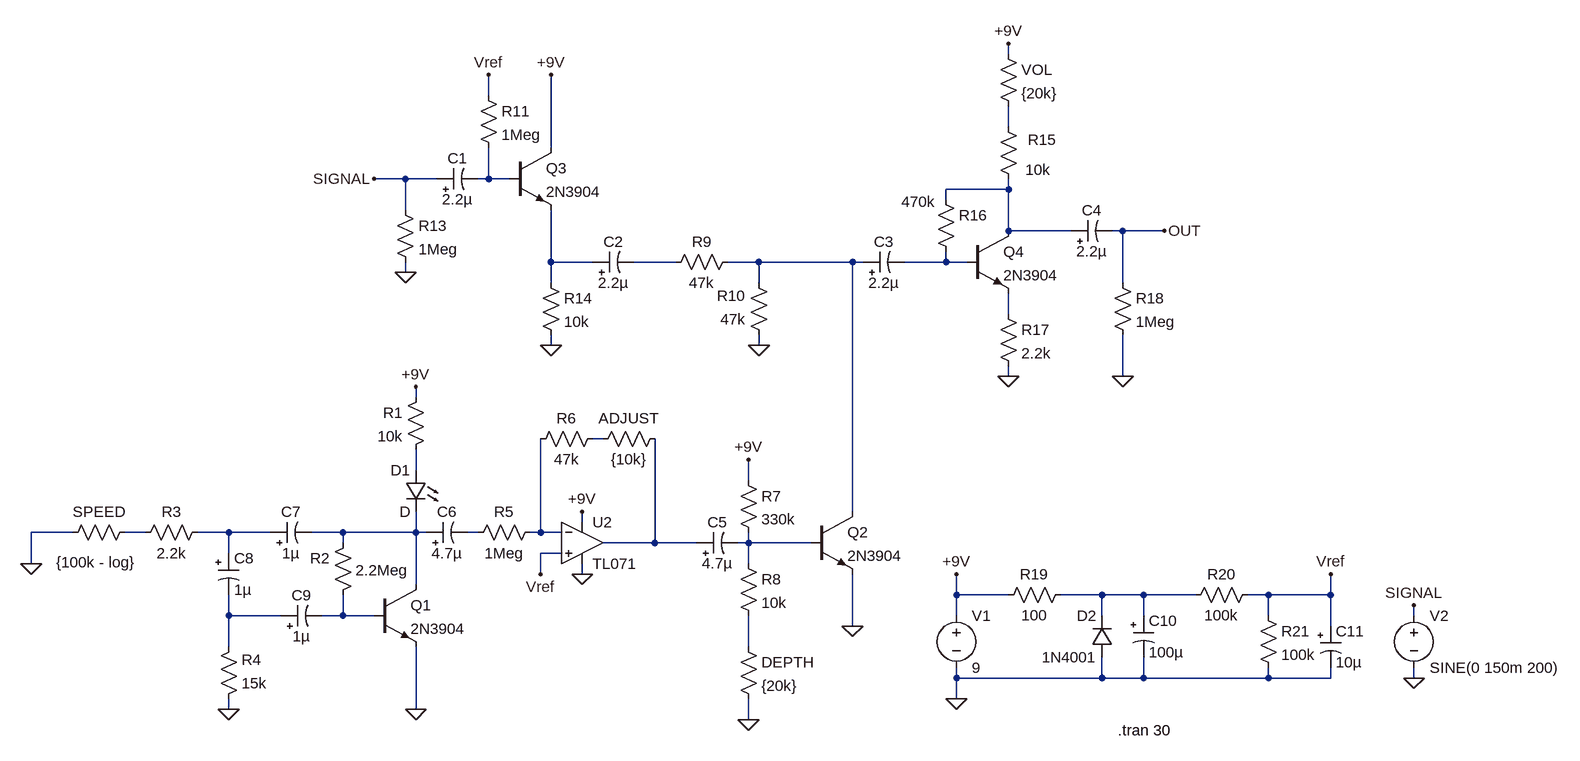
[diagram p0: schematic HatchetV2.asc]
HatchetV2.asc, the LTspice schematic file:
Version 4
SHEET 1 2232 680
WIRE 1376 -544 1376 -560
WIRE 576 -480 576 -512
WIRE 1376 -432 1376 -464
WIRE 672 -400 672 -512
WIRE 448 -352 400 -352
WIRE 496 -352 448 -352
WIRE 576 -352 576 -400
WIRE 576 -352 560 -352
WIRE 608 -352 576 -352
WIRE 1376 -336 1376 -352
WIRE 1376 -336 1280 -336
WIRE 1280 -320 1280 -336
WIRE 448 -304 448 -352
WIRE 1376 -272 1376 -336
WIRE 1472 -272 1376 -272
WIRE 1552 -272 1536 -272
WIRE 1616 -272 1552 -272
WIRE 672 -224 672 -304
WIRE 736 -224 672 -224
WIRE 864 -224 800 -224
WIRE 992 -224 944 -224
WIRE 1136 -224 992 -224
WIRE 1152 -224 1136 -224
WIRE 1280 -224 1280 -240
WIRE 1280 -224 1216 -224
WIRE 1312 -224 1280 -224
WIRE 448 -208 448 -224
WIRE 672 -192 672 -224
WIRE 992 -192 992 -224
WIRE 1552 -192 1552 -272
WIRE 1376 -144 1376 -176
WIRE 672 -96 672 -112
WIRE 992 -96 992 -112
WIRE 1376 -48 1376 -64
WIRE 1552 -48 1552 -112
WIRE 464 -16 464 -32
WIRE 752 48 736 48
WIRE 464 96 464 64
WIRE 976 112 976 80
WIRE 1136 160 1136 -224
WIRE 720 176 720 160
WIRE -64 192 -128 192
WIRE 48 192 16 192
WIRE 176 192 128 192
WIRE 240 192 176 192
WIRE 352 192 304 192
WIRE 464 192 464 160
WIRE 464 192 352 192
WIRE 480 192 464 192
WIRE 560 192 544 192
WIRE 656 192 656 48
WIRE 656 192 640 192
WIRE 688 192 656 192
WIRE 352 208 352 192
WIRE 832 208 832 48
WIRE 832 208 752 208
WIRE 896 208 832 208
WIRE 976 208 976 192
WIRE 976 208 960 208
WIRE 1072 208 976 208
WIRE 176 224 176 192
WIRE 688 224 656 224
WIRE -128 240 -128 192
WIRE 976 240 976 208
WIRE 656 256 656 224
WIRE 720 256 720 240
WIRE 464 272 464 192
WIRE 1296 288 1296 256
WIRE 1376 288 1296 288
WIRE 1520 288 1456 288
WIRE 1584 288 1520 288
WIRE 1664 288 1584 288
WIRE 1776 288 1744 288
WIRE 1872 288 1872 256
WIRE 1872 288 1776 288
WIRE 176 320 176 288
WIRE 256 320 176 320
WIRE 352 320 352 288
WIRE 352 320 320 320
WIRE 400 320 352 320
WIRE 1296 320 1296 288
WIRE 1520 320 1520 288
WIRE 1584 320 1584 288
WIRE 1776 320 1776 288
WIRE 2000 320 2000 304
WIRE 1136 336 1136 256
WIRE 1872 336 1872 288
WIRE 176 368 176 320
WIRE 976 368 976 320
WIRE 1296 416 1296 400
WIRE 1520 416 1520 384
WIRE 1520 416 1296 416
WIRE 1584 416 1584 384
WIRE 1584 416 1520 416
WIRE 1776 416 1776 400
WIRE 1776 416 1584 416
WIRE 1872 416 1872 400
WIRE 1872 416 1776 416
WIRE 2000 416 2000 400
WIRE 1296 448 1296 416
WIRE 176 464 176 448
WIRE 464 464 464 368
WIRE 976 480 976 448
FLAG 464 464 0
FLAG 464 -32 +9V
FLAG 176 464 0
FLAG 720 256 0
FLAG 720 160 +9V
FLAG 656 256 Vref
FLAG 976 80 +9V
FLAG 976 480 0
FLAG 1136 336 0
FLAG 992 -96 0
FLAG 672 -512 +9V
FLAG 672 -96 0
FLAG 1376 -48 0
FLAG 1616 -272 OUT
FLAG 576 -512 Vref
FLAG 448 -208 0
FLAG 1552 -48 0
FLAG 1296 448 0
FLAG 1296 256 +9V
FLAG 1872 256 Vref
FLAG 2000 416 0
FLAG 2000 304 SIGNAL
FLAG 1376 -560 +9V
FLAG 400 -352 SIGNAL
FLAG -128 240 0
SYMBOL npn 400 272 R0
SYMATTR InstName Q1
SYMATTR Value 2N3904
SYMBOL Res 480 -32 M0
SYMATTR InstName R1
SYMATTR Value 10k
SYMBOL LED 480 96 M0
SYMATTR InstName D1
SYMBOL Res 368 192 M0
WINDOW 3 -84 58 Left 2
SYMATTR InstName R2
SYMATTR Value 2.2Meg
SYMBOL Res 160 464 M180
WINDOW 0 36 76 Left 2
WINDOW 3 36 40 Left 2
SYMATTR InstName R4
SYMATTR Value 15k
SYMBOL TL071 720 208 R0
SYMATTR InstName U2
SYMBOL Res 656 176 R90
WINDOW 0 0 56 VBottom 2
WINDOW 3 32 56 VTop 2
SYMATTR InstName R5
SYMATTR Value 1Meg
SYMBOL Res 960 96 R0
SYMATTR InstName R7
SYMATTR Value 330k
SYMBOL Res 960 224 R0
SYMATTR InstName R8
SYMATTR Value 10k
SYMBOL npn 1072 160 R0
SYMATTR InstName Q2
SYMATTR Value 2N3904
SYMBOL Res 960 -240 R90
WINDOW 0 0 56 VBottom 2
WINDOW 3 32 56 VTop 2
SYMATTR InstName R9
SYMATTR Value 47k
SYMBOL Res 1008 -96 R180
WINDOW 0 36 76 Left 2
WINDOW 3 36 40 Left 2
SYMATTR InstName R10
SYMATTR Value 47k
SYMBOL npn 608 -400 R0
SYMATTR InstName Q3
SYMATTR Value 2N3904
SYMBOL Res 560 -496 R0
SYMATTR InstName R11
SYMATTR Value 1Meg
SYMBOL Res 656 -208 R0
SYMATTR InstName R14
SYMATTR Value 10k
SYMBOL npn 1312 -272 R0
SYMATTR InstName Q4
SYMATTR Value 2N3904
SYMBOL Res 1360 -448 R0
WINDOW 0 46 36 Left 2
WINDOW 3 42 82 Left 2
SYMATTR InstName R15
SYMATTR Value 10k
SYMBOL Res 1264 -336 R0
WINDOW 3 -53 19 Left 2
SYMATTR InstName R16
SYMATTR Value 470k
SYMBOL Res 1360 -160 R0
SYMATTR InstName R17
SYMATTR Value 2.2k
SYMBOL Res 144 176 R90
WINDOW 0 0 56 VBottom 2
WINDOW 3 32 56 VTop 2
SYMATTR InstName R3
SYMATTR Value 2.2k
SYMBOL Res 32 176 R90
WINDOW 0 0 56 VBottom 2
WINDOW 3 46 60 VTop 2
SYMATTR InstName SPEED
SYMATTR Value {100k - log}
SYMBOL polcap 496 -336 R270
WINDOW 0 32 32 VTop 2
WINDOW 3 0 32 VBottom 2
SYMATTR InstName C1
SYMATTR Value 2.2µ
SYMBOL polcap 736 -208 R270
WINDOW 0 32 32 VTop 2
WINDOW 3 0 32 VBottom 2
SYMATTR InstName C2
SYMATTR Value 2.2µ
SYMBOL polcap 1152 -208 R270
WINDOW 0 32 32 VTop 2
WINDOW 3 0 32 VBottom 2
SYMATTR InstName C3
SYMATTR Value 2.2µ
SYMBOL polcap 1472 -256 R270
WINDOW 0 32 32 VTop 2
WINDOW 3 0 32 VBottom 2
SYMATTR InstName C4
SYMATTR Value 2.2µ
SYMBOL polcap 896 224 R270
WINDOW 0 32 32 VTop 2
WINDOW 3 0 32 VBottom 2
SYMATTR InstName C5
SYMATTR Value 4.7µ
SYMBOL polcap 480 208 R270
WINDOW 0 32 32 VTop 2
WINDOW 3 0 32 VBottom 2
SYMATTR InstName C6
SYMATTR Value 4.7µ
SYMBOL polcap 240 208 R270
WINDOW 0 32 32 VTop 2
WINDOW 3 0 32 VBottom 2
SYMATTR InstName C7
SYMATTR Value 1µ
SYMBOL polcap 160 224 R0
SYMATTR InstName C8
SYMATTR Value 1µ
SYMBOL polcap 256 336 R270
WINDOW 0 32 32 VTop 2
WINDOW 3 0 32 VBottom 2
SYMATTR InstName C9
SYMATTR Value 1µ
SYMBOL Res 432 -320 R0
SYMATTR InstName R13
SYMATTR Value 1Meg
SYMBOL Res 1536 -208 R0
SYMATTR InstName R18
SYMATTR Value 1Meg
SYMBOL Voltage 1296 304 R0
SYMATTR InstName V1
SYMATTR Value 9
SYMBOL Res 1472 272 R90
WINDOW 0 0 56 VBottom 2
WINDOW 3 32 56 VTop 2
SYMATTR InstName R19
SYMATTR Value 100
SYMBOL diode 1536 384 R180
WINDOW 0 24 64 Left 2
WINDOW 3 24 0 Left 2
SYMATTR InstName D2
SYMATTR Value 1N4001
SYMBOL polcap 1568 320 R0
SYMATTR InstName C10
SYMATTR Value 100µ
SYMBOL Res 1760 272 R90
WINDOW 0 0 56 VBottom 2
WINDOW 3 32 56 VTop 2
SYMATTR InstName R20
SYMATTR Value 100k
SYMBOL Res 1760 304 R0
SYMATTR InstName R21
SYMATTR Value 100k
SYMBOL polcap 1856 336 R0
SYMATTR InstName C11
SYMATTR Value 10µ
SYMBOL Voltage 2000 304 R0
SYMATTR InstName V2
SYMATTR Value SINE(0 150m 200)
SYMBOL Res 960 352 R0
SYMATTR InstName DEPTH
SYMATTR Value {20k}
SYMBOL Res 1360 -560 R0
SYMATTR InstName VOL
SYMATTR Value {20k}
SYMBOL Res 752 32 R90
WINDOW 0 0 56 VBottom 2
WINDOW 3 32 56 VTop 2
SYMATTR InstName R6
SYMATTR Value 47k
SYMBOL Res 848 32 R90
WINDOW 0 0 56 VBottom 2
WINDOW 3 32 56 VTop 2
SYMATTR InstName ADJUST
SYMATTR Value {10k}
TEXT 1544 496 Left 2 !.tran 30

The netlist it stands for:
* HatchetV2.asc
Q1 N013 N020 0 0 2N3904
R1 +9V N010 10k
D1 N010 N013 D
R2 N013 N020 2.2Meg
R4 0 N019 15k
* U2: TL071 (symbol TL071 not available, pins judged from their places): In+=Vref In-=N015 V+=+9V V-=0 OUT=N016
R5 N015 N014 1Meg
R7 +9V N017 330k
R8 N017 N021 10k
Q2 N006 N017 0 0 2N3904
R9 N006 N005 47k
R10 0 N006 47k
Q3 +9V N002 N004 0 2N3904
R11 Vref N002 1Meg
R14 N004 0 10k
Q4 N003 N007 N008 0 2N3904
R15 N001 N003 10k
R16 N003 N007 470k
R17 N008 0 2.2k
R3 N012 N011 2.2k
R§SPEED N011 0 {100k - log}
C1 SIGNAL N002 2.2µ
C2 N004 N005 2.2µ
C3 N006 N007 2.2µ
C4 N003 OUT 2.2µ
C5 N016 N017 4.7µ
C6 N013 N014 4.7µ
C7 N012 N013 1µ
C8 N012 N019 1µ
C9 N019 N020 1µ
R13 SIGNAL 0 1Meg
R18 OUT 0 1Meg
V1 +9V 0 9
R19 N018 +9V 100
D2 0 N018 1N4001
C10 N018 0 100µ
R20 Vref N018 100k
R21 Vref 0 100k
C11 Vref 0 10µ
V2 SIGNAL 0 SINE(0 150m 200)
R§DEPTH N021 0 {20k}
R§VOL +9V N001 {20k}
R6 N009 N015 47k
R§ADJUST N016 N009 {10k}
.model D D
.lib standard.dio
.model NPN NPN
.model PNP PNP
.lib standard.bjt
.tran 30
.backanno
.end